# Altium schematic sheet LightLinkV2.SchDoc
size B; SheetNumber: 1; SheetTotal: 3
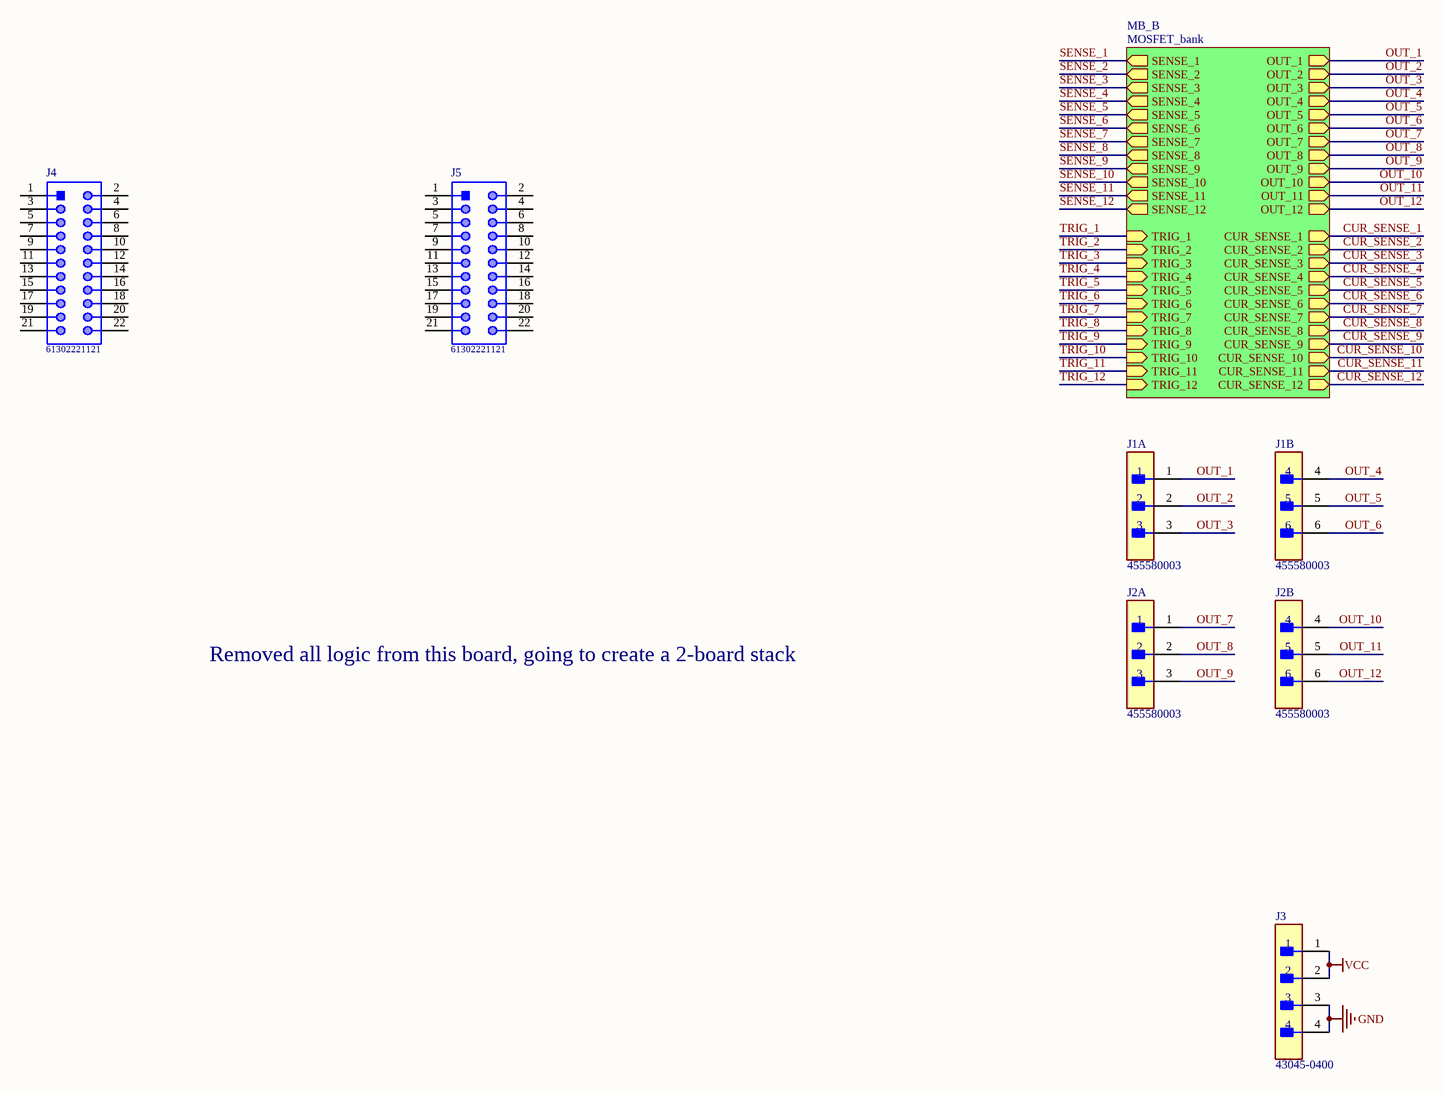
[diagram p0: LightLinkV2.SchDoc]

## Parts
J1  455580003  [FP-455580003-MFG]  (parts A,B of 2)
J2  455580003  [FP-455580003-MFG]  (parts A,B of 2)
J3  43045-0400  [FP-43045-0400-MFG]
J4  61302221121  [61302221121]
J5  61302221121  [61302221121]

## Sub-sheets
MB_B = MOSFET_bank: SENSE_1 (out), SENSE_2 (out), SENSE_3 (out), SENSE_4 (out), TRIG_1 (in), OUT_1 (out), TRIG_2 (in), OUT_2 (out), TRIG_3 (in), OUT_3 (out), TRIG_4 (in), OUT_4 (out), SENSE_5 (out), SENSE_6 (out), SENSE_7 (out), SENSE_8 (out), TRIG_5 (in), OUT_5 (out), TRIG_6 (in), OUT_6 (out), TRIG_7 (in), OUT_7 (out), TRIG_8 (in), OUT_8 (out), SENSE_9 (out), SENSE_10 (out), SENSE_11 (out), SENSE_12 (out), TRIG_9 (in), OUT_9 (out), TRIG_10 (in), OUT_10 (out), TRIG_11 (in), OUT_11 (out), TRIG_12 (in), OUT_12 (out), CUR_SENSE_1 (out), CUR_SENSE_2 (out), CUR_SENSE_3 (out), CUR_SENSE_4 (out), CUR_SENSE_5 (out), CUR_SENSE_6 (out), CUR_SENSE_12 (out), CUR_SENSE_11 (out), CUR_SENSE_10 (out), CUR_SENSE_9 (out), CUR_SENSE_8 (out), CUR_SENSE_7 (out)

## Nets
GND: J3.3 J3.4
VCC: J3.1 J3.2
CUR_SENSE_1: sheet MB_B/CUR_SENSE_1
CUR_SENSE_2: sheet MB_B/CUR_SENSE_2
CUR_SENSE_3: sheet MB_B/CUR_SENSE_3
CUR_SENSE_4: sheet MB_B/CUR_SENSE_4
CUR_SENSE_5: sheet MB_B/CUR_SENSE_5
CUR_SENSE_6: sheet MB_B/CUR_SENSE_6
CUR_SENSE_7: sheet MB_B/CUR_SENSE_7
CUR_SENSE_8: sheet MB_B/CUR_SENSE_8
CUR_SENSE_9: sheet MB_B/CUR_SENSE_9
CUR_SENSE_10: sheet MB_B/CUR_SENSE_10
CUR_SENSE_11: sheet MB_B/CUR_SENSE_11
CUR_SENSE_12: sheet MB_B/CUR_SENSE_12
OUT_1: J1.1 ; sheet MB_B/OUT_1
OUT_2: J1.2 ; sheet MB_B/OUT_2
OUT_3: J1.3 ; sheet MB_B/OUT_3
OUT_4: J1.4 ; sheet MB_B/OUT_4
OUT_5: J1.5 ; sheet MB_B/OUT_5
OUT_6: J1.6 ; sheet MB_B/OUT_6
OUT_7: J2.1 ; sheet MB_B/OUT_7
OUT_8: J2.2 ; sheet MB_B/OUT_8
OUT_9: J2.3 ; sheet MB_B/OUT_9
OUT_10: J2.4 ; sheet MB_B/OUT_10
OUT_11: J2.5 ; sheet MB_B/OUT_11
OUT_12: J2.6 ; sheet MB_B/OUT_12
SENSE_1: sheet MB_B/SENSE_1
SENSE_2: sheet MB_B/SENSE_2
SENSE_3: sheet MB_B/SENSE_3
SENSE_4: sheet MB_B/SENSE_4
SENSE_5: sheet MB_B/SENSE_5
SENSE_6: sheet MB_B/SENSE_6
SENSE_7: sheet MB_B/SENSE_7
SENSE_8: sheet MB_B/SENSE_8
SENSE_9: sheet MB_B/SENSE_9
SENSE_10: sheet MB_B/SENSE_10
SENSE_11: sheet MB_B/SENSE_11
SENSE_12: sheet MB_B/SENSE_12
TRIG_1: sheet MB_B/TRIG_1
TRIG_2: sheet MB_B/TRIG_2
TRIG_3: sheet MB_B/TRIG_3
TRIG_4: sheet MB_B/TRIG_4
TRIG_5: sheet MB_B/TRIG_5
TRIG_6: sheet MB_B/TRIG_6
TRIG_7: sheet MB_B/TRIG_7
TRIG_8: sheet MB_B/TRIG_8
TRIG_9: sheet MB_B/TRIG_9
TRIG_10: sheet MB_B/TRIG_10
TRIG_11: sheet MB_B/TRIG_11
TRIG_12: sheet MB_B/TRIG_12

Not connected (* = marked no-connect by the designer): J4 1 2 3 4 5 6 7 8 9 10 11 12 13 14 15 16 17 18 19 20 21 22; J5 1 2 3 4 5 6 7 8 9 10 11 12 13 14 15 16 17 18 19 20 21 22

## Notes on the sheet
- Removed all logic from this board, going to create a 2-board stack

## Library data of the parts
J1 J2 = CMP-04776-000024-1: CONN HEADER R/A 6POS 4.2MM; Manufacturer: Molex; Standoff Height: 0.4mm; Conn Orientation: Right Angle; Number Of Contacts: 6; Conn Gender: Male; Voltage Rating: 600V; Current Rating: 8A; Footprint Url: https://www.molex.com/pdm_docs/sd/455580003_sd.pdf; Number Of Rows: 2; Lead Free: Yes; Digikey Description: CONN HEADER R/A 6POS 4.2MM; ComponentLink2URL: https://www.molex.com/webdocs/datasheets/pdf/en-us/0455580003_PCB_HEADERS.pdf; Octopart: https://octopart.com/45558-0003-molex-7672845; Package: 0; Device Class L3: unset; ComponentLink2Description: Datasheet; Device Class L2: Headers and Wire Housings; Category: Conn; Contact Material: Tin,Nickel; Mouser Description: Conn Power HDR 6 POS 4.2mm Solder ST Thru-Hole 6 Terminal 1 Port Mini-Fit Jr™ Tray; Manufacturer Part Number: 455580003; Pitch: 4.2mm; Device Class L1: Connectors; Temperature Range Low: -40°C; Temperature: -40°C to +105°C; RoHS: TRUE; Temperature Range High: +105°C; Height: 10.38mm; Automotive: No
J3 = CMP-04776-000002-1: CONN HEADER R/A 4POS 3MM; Manufacturer: Molex; Conn Gender: Male; Conn Orientation: Right Angle; Voltage Rating: 600V; Number Of Contacts: 4; Is Female: yes; Current Rating: 8.5A; ComponentLink2URL: https://www.molex.com/webdocs/datasheets/pdf/en-us/0430450400_PCB_HEADERS.pdf; Manufacturer Part Number: 43045-0400; Digikey Description: CONN HEADER R/A 4POS 3MM; Category: Conn; Temperature Range High: +105°C; Lead Free: Yes; Device Class L1: Connectors; Automotive: No; Temperature: -40°C to +105°C; Footprint Url: https://www.molex.com/pdm_docs/sd/430450400_sd.pdf; Height: 9.27mm; Number Of Rows: 2; Device Class L3: unset; Pitch: 3mm; Temperature Range Low: -40°C; Contact Material: Tin,Nickel; Octopart: https://octopart.com/43045-0400-molex-287063; RoHS: TRUE; ComponentLink2Description: Datasheet; Package: 43045-0400; Device Class L2: Headers and Wire Housings
J4 J5 = CMP-1502-01108-1: THT Vertical Pin Header WR-PHD, Pitch 2.54 mm, Dual Row, 22 pins; Manufacturer: Wurth Elektronik; Working Voltage: 250VAC; Pin Number: 22; Withstanding Voltage: 500VAC; Rated Current: 3A; Contact Resistance: 20mOhm; Gender: Male; Pitch: 2.54mm; Publisher: WurthElektronik; Part Number: 61302221121; Mounting Technology: THT; Row Number: Dual; Orientation: Vertical; Operating Temperature: -40to105degC; Manufacturer URL: http://www.we-online.de; Packaging: Bag; Datasheet URL: https://katalog.we-online.de/em/datasheet/6130xx21121.pdf; Package Reference: 61302221121